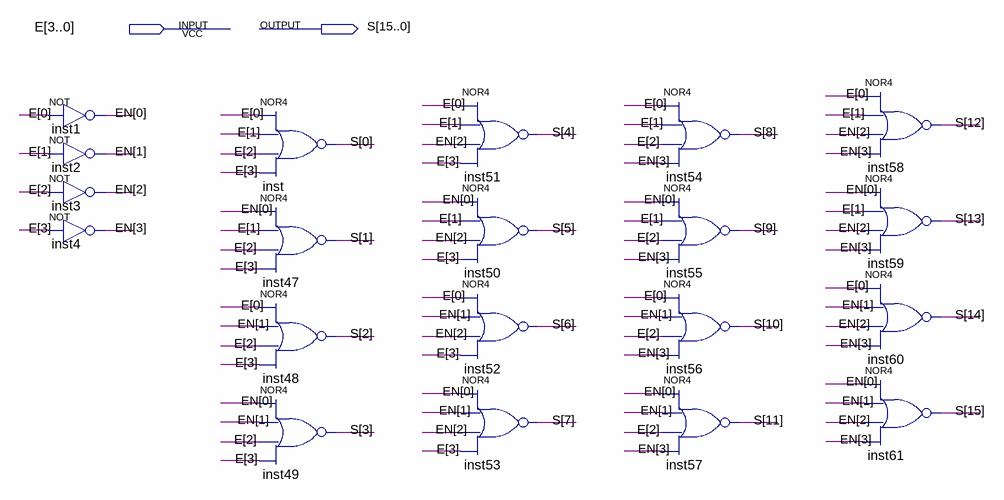
[diagram p0: schematic sheet]
// Quartus schematic decoder.bdf as structural Verilog: 20 symbols, 2 pins
module decoder (
  input  [3:0] E,
  output [15:0] S
);

  wire [3:0] EN;

  not inst1 (EN[0], E[0]);
  not inst2 (EN[1], E[1]);
  not inst3 (EN[2], E[2]);
  not inst4 (EN[3], E[3]);
  nor inst (S[0], E[0], E[1], E[2], E[3]);
  nor inst47 (S[1], EN[0], E[1], E[2], E[3]);
  nor inst48 (S[2], E[0], EN[1], E[2], E[3]);
  nor inst49 (S[3], EN[0], EN[1], E[2], E[3]);
  nor inst51 (S[4], E[0], E[1], EN[2], E[3]);
  nor inst50 (S[5], EN[0], E[1], EN[2], E[3]);
  nor inst52 (S[6], E[0], EN[1], EN[2], E[3]);
  nor inst53 (S[7], EN[0], EN[1], EN[2], E[3]);
  nor inst54 (S[8], E[0], E[1], E[2], EN[3]);
  nor inst55 (S[9], EN[0], E[1], E[2], EN[3]);
  nor inst56 (S[10], E[0], EN[1], E[2], EN[3]);
  nor inst57 (S[11], EN[0], EN[1], E[2], EN[3]);
  nor inst58 (S[12], E[0], E[1], EN[2], EN[3]);
  nor inst59 (S[13], EN[0], E[1], EN[2], EN[3]);
  nor inst60 (S[14], E[0], EN[1], EN[2], EN[3]);
  nor inst61 (S[15], EN[0], EN[1], EN[2], EN[3]);
endmodule
